# EAGLE design Christmass tree (EAGLE 9.2.2)
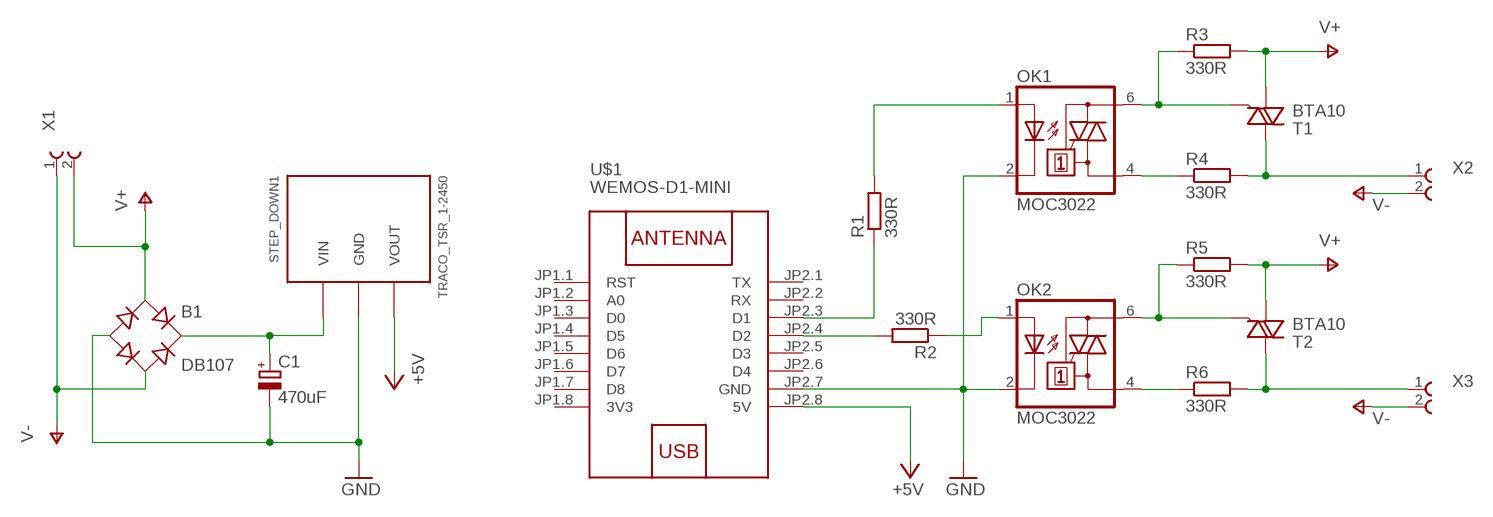
[diagram p0: schematic, sheet 1]

## Parts
B1  DB107  DBDB107G  [DB]
C1  470uF  CPOL-EUE5-10.5  [E5-10,5]
OK1  MOC3022  MOC3031M  [DIL06]
OK2  MOC3022  MOC3031M  [DIL06]
R1  330R  R-EU_0204/7  [0204/7]
R2  330R  R-EU_0204/7  [0204/7]
R3  330R  R-EU_0204/7  [0204/7]
R4  330R  R-EU_0204/7  [0204/7]
R5  330R  R-EU_0204/7  [0204/7]
R6  330R  R-EU_0204/7  [0204/7]
STEP_DOWN1  TRACO_TSR_1-2450  [TRACO_TSR_1-2450]
T1  BTA10  TIC253  [TO218DS]
T2  BTA10  TIC253  [TO218DS]
U$1  WEMOS-D1-MINI  WEMOS-D1-MINIBEZ_POTISKU  [WEMOS-D1-MINI_BEZ]
X1  2PIN_5MM_TERMINAL  [2PIN_5MM_TERMMINAL]
X2  2PIN_5MM_TERMINAL  [2PIN_5MM_TERMMINAL]
X3  2PIN_5MM_TERMINAL  [2PIN_5MM_TERMMINAL]

## Nets
+5V: STEP_DOWN1.VOUT U$1.JP2.8(5V)
GND: B1.- C1.- OK1.2(C) OK2.2(C) STEP_DOWN1.GND U$1.JP2.7(GND)
N$2: OK2.1(A) R2.1
N$3: B1.+ C1.+ STEP_DOWN1.VIN
N$4: R2.2 U$1.JP2.4(D2)
N$5: R1.1 U$1.JP2.3(D1)
N$6: OK1.1(A) R1.2
N$7: OK1.6(A2) R3.1 T1.G
N$8: OK2.6(A2) R5.1 T2.G
N$9: OK1.4(A1) R4.1
N$10: R4.2 T1.A2 X2.1
N$13: OK2.4(A1) R6.1
N$14: R6.2 T2.A2 X3.1
V+: B1.AC1 R3.2 R5.2 T1.A1 T2.A1 X1.2
V-: B1.AC2 X1.1 X2.2 X3.2
Unconnected: U$1.JP1.1(RST) U$1.JP1.2(A0) U$1.JP1.3(D0) U$1.JP1.4(D5) U$1.JP1.5(D6) U$1.JP1.6(D7) U$1.JP1.7(D8) U$1.JP2.1(TX) U$1.JP2.2(RX) U$1.JP2.5(D3) U$1.JP2.6(D4)

## Power pins joined to a net without a drawn wire
3V3: U$1.JP1.8(3V3)

## Library data of the parts
B1 = rectifier:DB?*G: Single Phase 1.0 AMP Glass Passivated Bridge Rectifier Taiwan Semiconductor Co.,Ltd. - TSC Source: http://www.taiwansemi.com/TSCbig5/ezcatfiles/cust/img/img/db101g.pdf http://www.ts.com.tw/db/pictures/modules/PDT/PDT060207001/DBLS201G.pdf
C1 = resistor:CPOL-EU: POLARIZED CAPACITOR, European symbol
OK1 OK2 = optocoupler:MOC30*: 6-Pin DIP Zero-Cross Optoisolators Triac Driver Output (250/400 Volt Peak) Source: Data sheet <http://www.fairchildsemi.com/ds/MO/MOC3031M.pdf> The old path of data sheet not more available 2013-05-06.; MF: FAIRCHILD SEMICONDUCTOR; MPN: MOC3031M; OC_FARNELL: 9875964; OC_NEWARK: 78K6089
R1-R6 = resistor:R-EU_: RESISTOR, European symbol
STEP_DOWN1 = Voltage:TRACO_TSR_1-2450
T1 T2 = triac:TIC253: TRIAC
U$1 = Sbirka modulu:WEMOS-D1-MINI: WEMOS D1 mini: Mini Wi-Fi Board based on ESP-8266 device More details can be found here: https://www.wemos.cc/product/d1-mini.html Click here to find device on ebay.com <http://www.ebay.com/sch/wemos+d1+mini+nodemcu>
X1-X3 = Terminaly:2PIN_5MM_TERMINAL

## Board
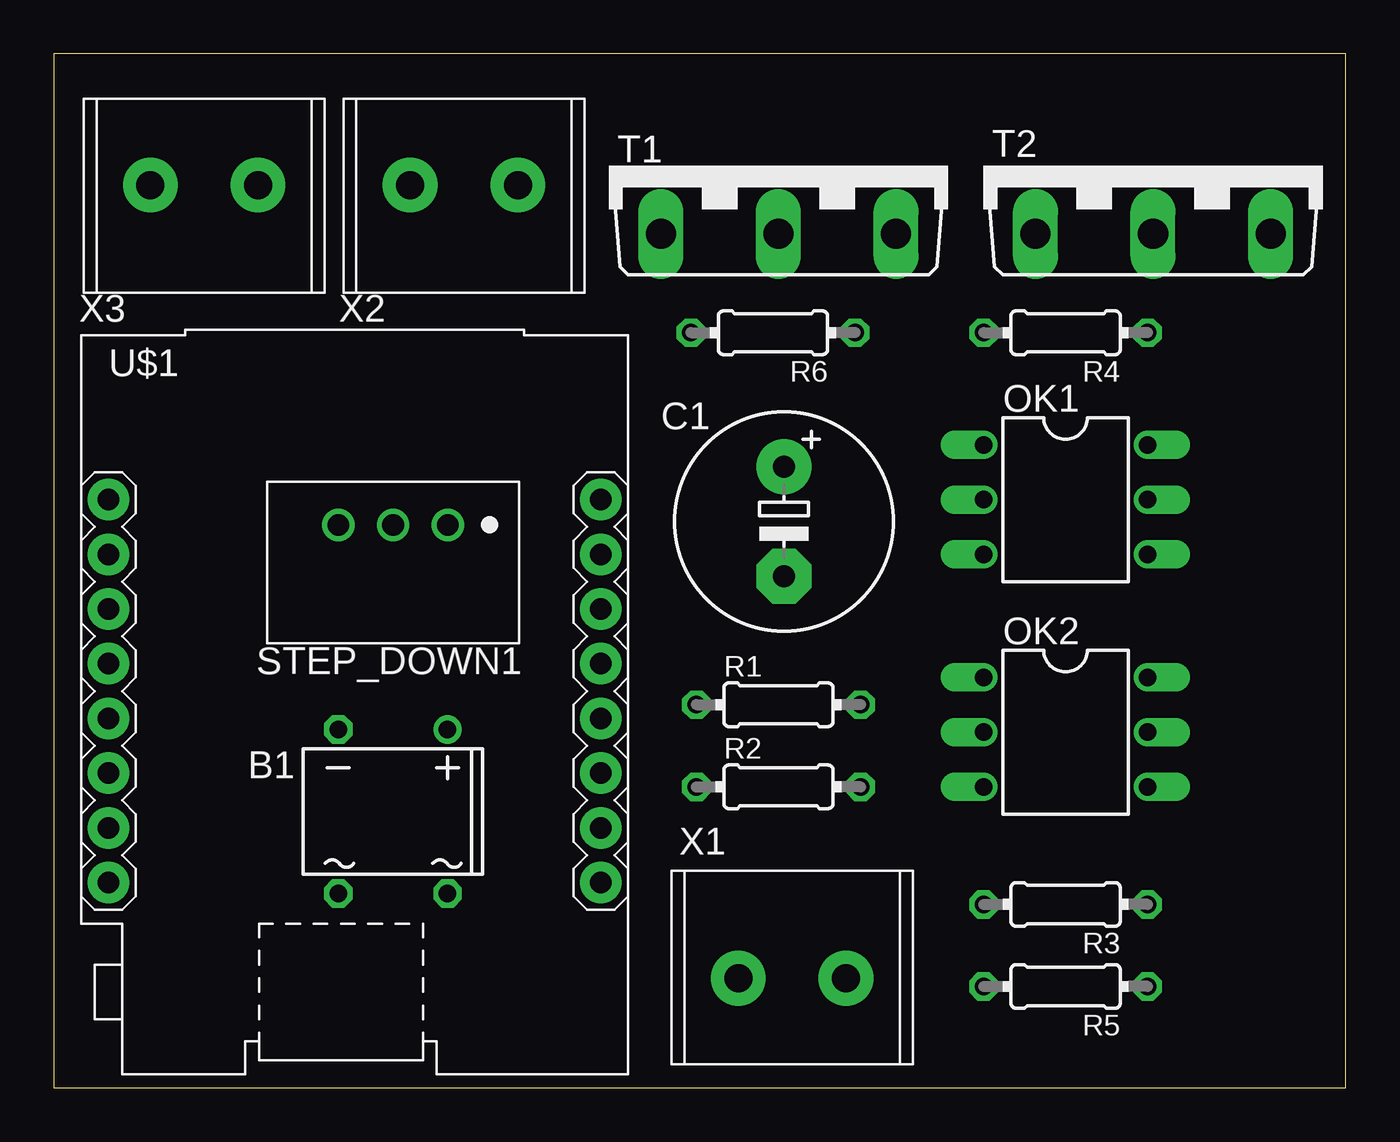
[diagram p1: board, top side]
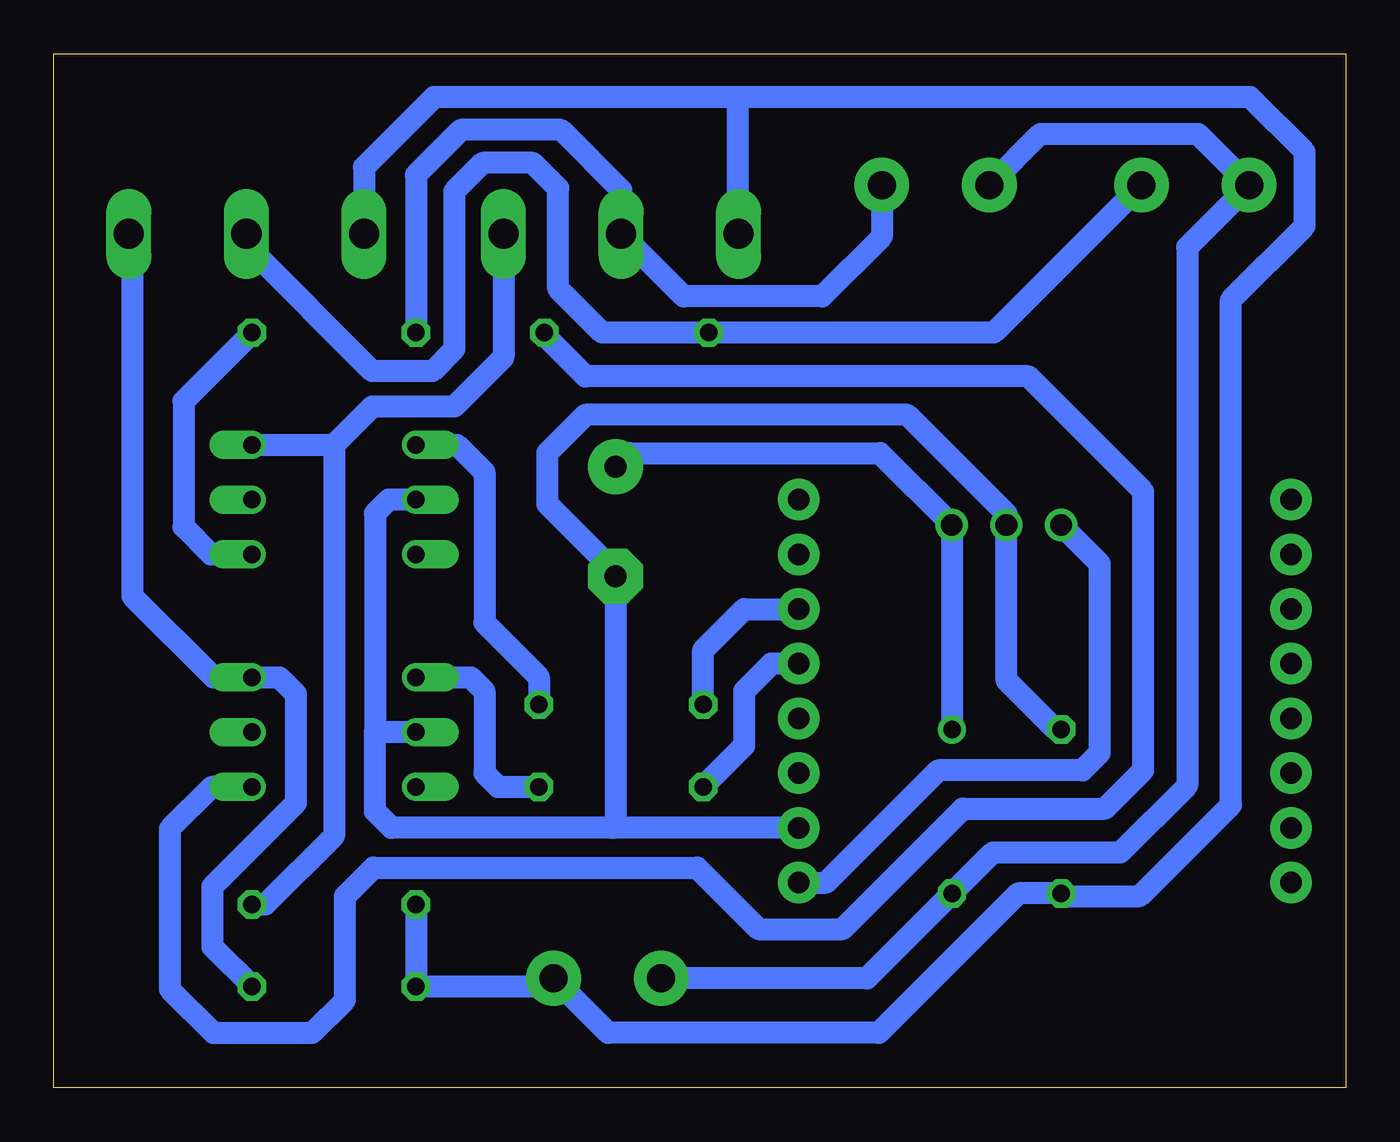
[diagram p2: board, bottom side, seen from below]

Size 60 x 48 mm. Coordinates in mm from the lower left corner, seen from the top.
Outline: 0,0 60,0 60,48 0,48 0,0
Copper layers (1*16): Top 0.035mm / dielectric 1.5mm / Bottom 0.035mm
Design rules "default": minimum track width 6mil, minimum drill 0.35mm, track to track 6mil, track to pad 6mil, pad to pad 6mil, via to via 6mil, smd to smd 6mil, copper to edge 40mil, drill to drill 6mil, minimum pad ring 10mil, minimum via ring 8mil, stop-mask expansion 4mil, vias tented up to drill 0mil, thermal gap 10mil

### Footprints (pad centres in the part's own frame; a part is rotated, then mirrored left to right if it is on the bottom)
DB = drill 0.813: + -2.54,-3.81 | drill 0.813 octagon: - 2.54,-3.81; AC1 2.54,3.81; AC2 -2.54,3.81
E5-10,5 = drill 1.016 pad 2.54: + -2.54,0 | drill 1.016 pad 2.54 octagon: - 2.54,0
DIL06 = drill 0.813 offset: 1 -2.54,-3.81; 2 0,-3.81; 3 2.54,-3.81; 4 2.54,3.81; 5 0,3.81; 6 -2.54,3.81
0204/7 = drill 0.813 octagon: 1 -3.81,0; 2 3.81,0
TRACO_TSR_1-2450 = drill 1: GND -0.01,-1.75; VIN -2.55,-1.75; VOUT 2.53,-1.75
TO218DS = drill 1.397 long: A1 -5.461,-3.175; A2 0,-3.175; G 5.461,-3.175
WEMOS-D1-MINI_BEZ = drill 1 pad 1.93: JP1.1 -11.43,9.525; JP1.2 -11.43,6.985; JP1.3 -11.43,4.445; JP1.4 -11.43,1.905; JP1.5 -11.43,-0.635; JP1.6 -11.43,-3.175; JP1.7 -11.43,-5.715; JP1.8 -11.43,-8.255; JP2.1 11.43,9.525; JP2.2 11.43,6.985; JP2.3 11.43,4.445; JP2.4 11.43,1.905; JP2.5 11.43,-0.635; JP2.6 11.43,-3.175; JP2.7 11.43,-5.715; JP2.8 11.43,-8.255
2PIN_5MM_TERMMINAL = drill 1.3 pad 2.54: 1 -2.5,0; 2 2.5,0

### Placement (x,y rotation side)
B1  15.75,12.83 180 top
C1  33.91,26.29 270 top
OK1  46.99,27.3 270 top
OK2  46.99,16.51 270 top
R1  33.66,17.78 0 top
R2  33.66,13.97 180 top
R3  46.99,8.51 180 top
R4  46.99,35.05 180 top
R5  46.99,4.7 180 top
R6  33.4,35.05 180 top
STEP_DOWN1  15.75,24.38 180 top
T1  33.66,42.81 0 top
T2  51.05,42.81 0 top
U$1  13.97,17.78 0 top
X1  34.29,5.08 0 top
X2  19.05,41.91 180 top
X3  6.99,41.91 180 top

### Tracks (layer width: path | path; a pad name or v marks a point on that pad's centre or on a via)
+5V
  Bottom 1.016: U$1.JP2.8 24.13,9.53 18.92,14.73 12.23,14.73 11.43,15.53 11.43,24.35 STEP_DOWN1.VOUT
GND
  Bottom 1.016: OK1.2 44.45,27.3 45.09,26.67 45.09,16.51 | OK2.2 45.09,16.51 | U$1.JP2.7 34.04,12.06 | 34.04,12.06 44.32,12.06 45.09,12.83 45.09,16.51 | 34.04,12.06 33.91,12.19 C1.- 33.91,23.93 37.08,27.11 37.08,29.46 35.31,31.24 20.36,31.24 15.76,26.64 STEP_DOWN1.GND 15.76,18.91 13.48,16.64 B1.-
N$2
  Bottom 1.016: OK2.1 40.64,19.05 40.01,18.41 40.01,14.61 39.37,13.97 R2.1
N$3
  Bottom 1.016: B1.+ STEP_DOWN1.VIN 21.63,29.46 33.27,29.46 C1.+
N$4
  Bottom 1.016: U$1.JP2.4 26.67,19.68 27.94,18.41 27.94,15.88 R2.2
N$5
  Bottom 1.016: R1.1 29.84,20.32 27.94,22.23 U$1.JP2.3
N$6
  Bottom 1.016: OK1.1 41.27,29.84 40.01,28.57 40.01,21.59 37.47,19.05 R1.2
N$7
  Bottom 1.016: R3.1 50.16,8.51 46.99,11.68 46.99,29.84 | OK1.6 46.99,29.84 | T1.G 39.12,33.91 41.4,31.62 45.21,31.62 46.99,29.84
N$8
  Bottom 1.016: R5.1 52.64,6.54 52.64,9.34 48.77,13.21 48.77,18.29 49.53,19.05 OK2.6 52.58,19.05 56.35,22.82 56.35,39.48 T2.G
N$9
  Bottom 1.016: R4.1 53.98,31.88 53.98,26.04 52.7,24.77 OK1.4
N$10
  Bottom 1.016: X2.1 21.55,39.51 24.32,36.74 30.75,36.74 T1.A2 33.66,41.67 36.45,44.47 41.09,44.47 43.18,42.38 R4.2
N$13
  Bottom 1.016: OK2.4 52.65,13.97 54.61,12.01 54.61,4.57 52.58,2.54 48.01,2.54 46.48,4.06 46.48,8.89 45.16,10.21 30.12,10.21 27.27,7.37 23.37,7.37 17.78,12.95 11.18,12.95 9.4,14.73 9.4,27.69 14.73,33.02 35.31,33.02 37.21,34.92 R6.1
N$14
  Bottom 1.016: X3.1 16.34,35.05 R6.2 34.53,35.05 36.58,37.1 36.58,41.76 37.75,42.94 40.08,42.94 41.4,41.62 41.4,34.29 42.42,33.27 45.21,33.27 51.05,39.12 T2.A2
V+
  Bottom 1.016: R3.2 R5.2 37.17,4.7 X1.2 34.25,2.54 21.68,2.54 15.21,9.02 B1.AC1 13.08,8.89 9.56,8.89 5.33,13.12 5.33,36.58 1.91,40.01 1.91,43.45 4.45,45.99 28.25,45.99 | T2.A1 45.59,42.74 42.34,45.99 28.25,45.99 | 28.25,45.99 28.25,39.69 T1.A1
V-
  Bottom 1.016: X2.2 14.18,44.28 6.86,44.28 X3.2 7.37,39.03 7.37,14.02 10.47,10.92 16.38,10.92 B1.AC2 22.23,5.08 X1.1